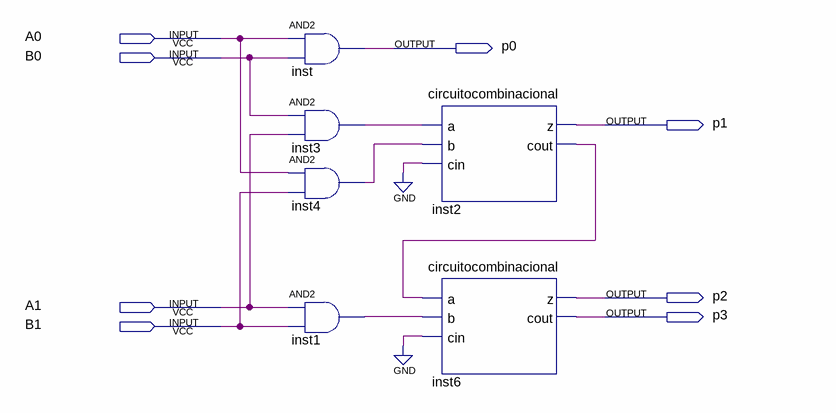
[diagram p0: schematic sheet]
// Quartus schematic MultiplicadorSinSigno.bdf as structural Verilog: 6 symbols, 8 pins
module MultiplicadorSinSigno (
  input  A0,
  input  B0,
  input  A1,
  input  B1,
  output p0,
  output p1,
  output p2,
  output p3
);

  wire inst1_out, inst2_cout, inst3_out, inst4_out;

  and inst (p0, A0, B0);
  and inst3 (inst3_out, B0, A1);
  and inst4 (inst4_out, A0, B1);
  and inst1 (inst1_out, A1, B1);
  circuitocombinacional inst2 (.a(inst3_out), .b(inst4_out), .cin(1'b0), .z(p1), .cout(inst2_cout));
  circuitocombinacional inst6 (.a(inst2_cout), .b(inst1_out), .cin(1'b0), .z(p2), .cout(p3));
endmodule
